# Altium project CU2.PrjPcb
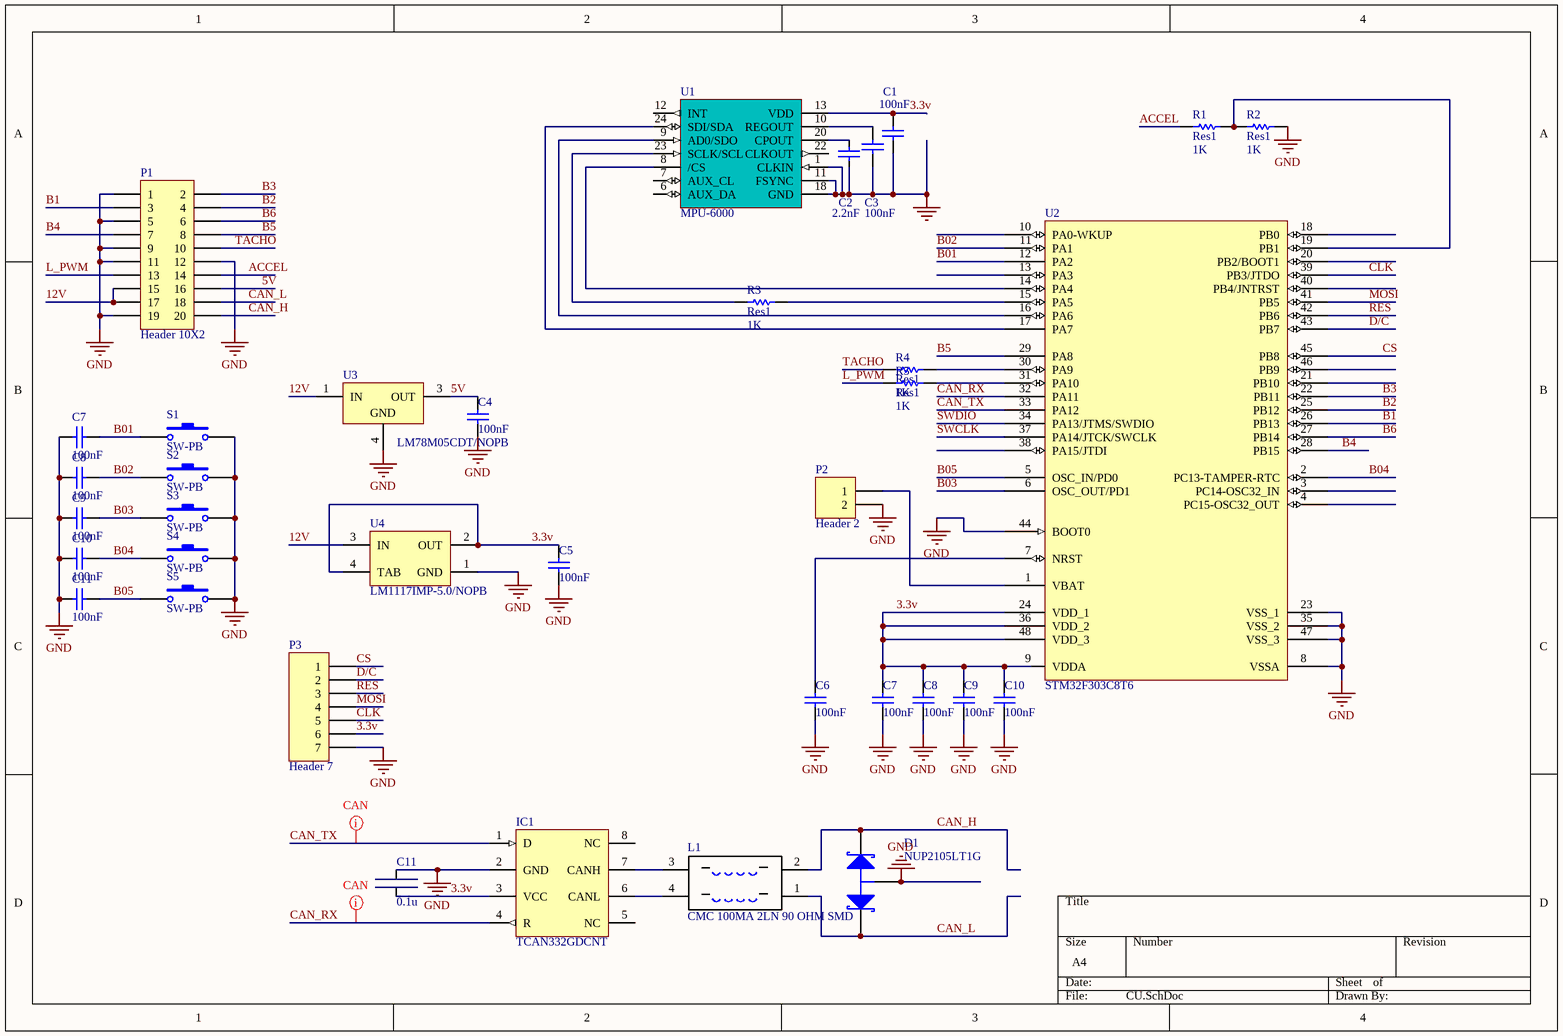
[diagram p0: CU.SchDoc]
1 sheet, 36 parts. Net scope: global (net labels, ports and power ports of the same name join across sheets).
Board file: CU.PcbDoc

## Sheet CU.SchDoc
size A4

### Parts
(Parts that share a designator on the sheet are numbered #1, #2 ... from top to bottom, then left to right.)
C1  value 100nF  [0603x]  (hidden comment: Cap402)
C2  value 2.2nF  [0603x]  (hidden comment: Cap603)
C3  value 100nF  [0402x]  (hidden comment: Cap402)
C4  value 100nF  [RR_B]  (hidden comment: Cap)
C5  value 100nF  [RR_B]  (hidden comment: Cap)
C6  value 100nF  [0603x]  (hidden comment: Cap)
C7#1  value 100nF  [0603x]  (hidden comment: Cap)
C7#2  value 100nF  [0603x]  (hidden comment: Cap)
C8#1  value 100nF  [0603x]  (hidden comment: Cap)
C8#2  value 100nF  [0603x]  (hidden comment: Cap)
C9#1  value 100nF  [0603x]  (hidden comment: Cap)
C9#2  value 100nF  [0603x]  (hidden comment: Cap)
C10#1  value 100nF  [0603x]  (hidden comment: Cap)
C10#2  value 100nF  [0603x]  (hidden comment: Cap)
C11#1  value 100nF  [0603x]  (hidden comment: Cap)
C11#2  0.1u  [CAPC1608X08N(0603)]
D1  NUP2105LT1G  [SOT23_N]
IC1  TCAN332GDCNT  [SOT23-8_L]
L1  CMC 100MA 2LN 90 OHM SMD  [Choke_smd]
P1  Header 10X2  [HDR2X10]
P2  Header 2  [RR_CONN_2032]
P3  Header 7  [HDR1X7]
R1  Res1  value 1K  [0603x]
R2  Res1  value 1K  [0603x]
R3  Res1  value 1K  [0603x]
R4  Res1  value 1K  [0603x]
R5  Res1  value 1K  [0603x]
S1  SW-PB  [BUTTON_SMD]
S2  SW-PB  [BUTTON_SMD]
S3  SW-PB  [BUTTON_SMD]
S4  SW-PB  [BUTTON_SMD]
S5  SW-PB  [BUTTON_SMD]
U1  MPU-6000  [IMU-3000]
U2  STM32F303C8T6  [LQFP48_N]
U3  LM78M05CDT/NOPB  [TD03B_N]
U4  LM1117IMP-5.0/NOPB  [MP04A_N]

### Nets
GND: C1.1 C2.1 C3.2 C4.1 C5.1 C6.1 C7#1.2 C7#2.1 C8#1.2 C8#2.1 C9#1.2 C9#2.1 C10#1.2 C10#2.1 C11#1.2 C11#2.1 D1.3(A) IC1.2(GND) P1.1 P1.5 P1.9 P1.11 P1.12 P1.19 P2.2 P3.7 R2.2 S1.1 S2.1 S3.1 S4.1 S5.1 U1.1(CLKIN) U1.11(FSYNC) U1.18(GND) U2.8(VSSA) U2.23(VSS_1) U2.35(VSS_2) U2.44(BOOT0) U2.47(VSS_3) U3.4(GND) U4.1(GND)
3.3v: C1.2 C5.2 C7#2.2 C8#2.2 C9#2.2 C10#2.2 C11#2.2 IC1.3(VCC) P3.6 U1.13(VDD) U2.9(VDDA) U2.24(VDD_1) U2.36(VDD_2) U2.48(VDD_3) U4.2(OUT) U4.4(TAB)
5V: C4.2 P1.16 U3.3(OUT)
12V: P1.15 P1.17 U3.1(IN) U4.3(IN)
ACCEL: P1.14 R1.1
B01: C7#1.1 S1.2 U2.12(PA2)
B1: P1.3 U2.26(PB13)
B02: C8#1.1 S2.2 U2.11(PA1)
B2: P1.4 U2.25(PB12)
B03: C9#1.1 S3.2 U2.6(OSC_OUT/PD1)
B3: P1.2 U2.22(PB11)
B4: P1.7 U2.28(PB15)
B04: C10#1.1 S4.2 U2.2(PC13-TAMPER-RTC)
B05: C11#1.1 S5.2 U2.5(OSC_IN/PD0)
B5: P1.8 U2.29(PA8)
B6: P1.6 U2.27(PB14)
CAN_H: D1.2(K2) L1.2 P1.20
CAN_L: D1.1(K1) L1.1 P1.18
CAN_RX: IC1.4(R) U2.32(PA11)
CAN_TX: IC1.1(D) U2.33(PA12)
CLK: P3.5 U2.39(PB3/JTDO)
CS: P3.1 U2.45(PB8)
D/C: P3.2 U2.43(PB7)
L_PWM: P1.13 R5.1
MOSI: P3.4 U2.41(PB5)
RES: P3.3 U2.42(PB6)
SWCLK: U2.37(PA14/JTCK/SWCLK)
SWDIO: U2.34(PA13/JTMS/SWDIO)
TACHO: P1.10 R4.1
NetC2_2: C2.2 U1.20(CPOUT)
NetC3_1: C3.1 U1.10(REGOUT)
NetC6_2: C6.2 U2.7(NRST)
NetIC1_6: IC1.6(CANL) L1.4
NetIC1_7: IC1.7(CANH) L1.3
NetP2_1: P2.1 U2.1(VBAT)
NetR1_2: R1.2 R2.1 U2.19(PB1)
NetR3_1: R3.1 U1.23(SCLK/SCL)
NetR3_2: R3.2 U2.15(PA5)
NetR4_2: R4.2 U2.30(PA9)
NetR5_2: R5.2 U2.31(PA10)
NetU1_8: U1.8(/CS) U2.14(PA4)
NetU1_9: U1.9(AD0/SDO) U2.16(PA6)
NetU1_24: U1.24(SDI/SDA) U2.17(PA7)

Not connected (* = marked no-connect by the designer): IC1 5(NC) 8(NC); U1 2(NC) 3(NC) 4(NC) 5(NC) 6(AUX_DA) 7(AUX_CL) 12(INT) 14(NC) 15(NC) 16(NC) 17(NC) 19(RESV) 21(RESV) 22(CLKOUT); U2 3(PC14-OSC32_IN) 4(PC15-OSC32_OUT) 10(PA0-WKUP) 13(PA3) 18(PB0) 20(PB2/BOOT1) 21(PB10) 38(PA15/JTDI) 40(PB4/JNTRST) 46(PB9)

### Layout directives
net class CAN: CAN_RX, CAN_TX

### Library data of the parts
C1 C3 = Cap402: Capacitor SMD; Published: 1-Nov-2010; LatestRevisionDate: 1-Nov-2010; LatestRevisionNote: Released OpenPilot Lib; PackageReference: 0402 (1005 Metric); Publisher: The OpenPilot Project; ComponentLink2Description: Datasheet; Supplier 1: Digi-Key; Supplier Part Number 1: 445-4952-1-ND
C2 = Cap603: Capacitor SMD; Published: 1-Nov-2010; LatestRevisionDate: 1-Nov-2010; LatestRevisionNote: Released OpenPilot Lib; PackageReference: 0603 (1608 Metric); Publisher: The OpenPilot Project; Supplier 1: Digi-Key; Supplier Part Number 1: 445-1309-1-ND
C4-C6 C7#1 C7#2 C8#1 C8#2 C9#1 C9#2 C10#1 C10#2 C11#1 = Cap: Capacitor; Published: 8-Jun-2000; LatestRevisionDate: 17-Jul-2002; LatestRevisionNote: Re-released for DXP Platform.; PackageReference: RAD-0.3; Publisher: Altium Limited; PackageDescription: Radial Cap, Thru-Hole; 2 Leads; 0.3 in Pin Spacing
C11#2 = Ceramic Chip Capacitor: Value: CAP CER 0.1UF 50V X7R 0603; Order Number: 06035C104KAT2A; Distributor: AVX Corporation; Package: 0603
D1 = BAT54A: Schottky Barrier Double Diode; LatestRevisionNote: IPC-7351 Footprint Added.; Package: SOT23; PackageDescription: 3-Pin SOT-23 Package 0.95 mm Pitch, 2.3 mm Lead Span; ComponentLink1Description: Manufacturer Link; ComponentLink1URL: http://www.semiconductors.philips.com/; Value: NUP2105LT1G; Distributor: ON Semiconductor; Order Number: NUP2105LT1G
L1 = Choke: Order Number: EXC-34CG900U; Distributor: Panasonic; Value: CMC 100MA 2LN 90 OHM SMD; Package: 0805 (2012 Metric), 4 PC Pad
P1 = Header 10X2: Header, 10-Pin, Dual row; LatestRevisionDate: 17-Jul-2002; LatestRevisionNote: Re-released for DXP Platform.; Publisher: Altium Limited
P2 = Header 2: Header, 2-Pin; LatestRevisionDate: 17-Jul-2002; LatestRevisionNote: Re-released for DXP Platform.; Publisher: Altium Limited
P3 = Header 7: Header, 7-Pin; LatestRevisionDate: 17-Jul-2002; LatestRevisionNote: Re-released for DXP Platform.; Publisher: Altium Limited
R1-R5 = Res1: Resistor; Published: 8-Jun-2000; LatestRevisionDate: 17-Jul-2002; LatestRevisionNote: Re-released for DXP Platform.; PackageReference: AXIAL-0.3; Publisher: Altium Limited; PackageDescription: Axial Device, Thru-Hole; 2 Leads; 0.3 in Pin Spacing
S1-S5 = SW-PB: Switch; Published: 24-Mar-1999; LatestRevisionDate: 17-Jul-2002; LatestRevisionNote: Re-released for DXP Platform.; PackageReference: SPST-2; Publisher: Altium Limited; PackageDescription: Switch; 2 Leads
U1 = MPU-3/6000: Invensense MPU-3/6000,  3-axis Gyros & Accel on 6000; ComponentLink2Description: Datasheet; LatestRevisionDate: 1-Nov-2010; LatestRevisionNote: Released OpenPilot Lib; Published: 1-Nov-2010; Publisher: The OpenPilot Project; Manufacturer: Invensense; Supplier 1: Invensense; Supplier Part Number 1: MPU-6000
U2 = STM32F103C6T6: STM32 ARM-based 32-bit MCU with 32 Kbytes Flash, 48-pin LQFP, Industrial Temperature; Published: 30-May-2008; DatasheetVersion: rev6, Mar-2008; PackageVersion: Mar-2008; PackageReference: LQFP48; Publisher: Altium Limited; PackageDescription: 48-Pin Low-Profile Quad Flat Pack, 7 x 7 mm Body, 0.5 mm Pitch (LQFP48); ComponentLink1Description: Manufacturer Link; ComponentLink1URL: www.st.com/stm32; ComponentLink2Description: Datasheet; ComponentLink2URL: http://www.st.com/stonline/products/literature/ds/13587.pdf
U3 = LM78M05CDT/NOPB: 3-Terminal Positive Voltage Regulators, 3-pin TO-252, Pb-Free; Manufacturer: National Semiconductor; PackageTopMarking: NSUZXYTT*LM78M05*CDT; PowerWise: N; CompType: LDO IC; Published: 1-Mar-2010; DatasheetVersion: Aug-2005; PackageVersion: revD, Feb-2009; PackageReference: TD03B; Publisher: Altium Limited; PackageDescription: TO252, Molded, Jedec, 6.8 x 6.10 x 2.30mm Body, 3 Lead, 2.28mm Pitch, Surface Mount; Supplier 1: Digi-Key; Supplier Part Number 1: LM78M05CDT-ND; Supplier 2: Farnell; Supplier Part Number 2: 1469112; PartNumber: LM78M05CDT/NOPB; RoHS: Y; PinCount: 3; Code_JEDEC: TO-252-AA; ComponentLink1Description: LM78M05 Datasheet; ComponentLink1URL: http://www.national.com/ds/LM/LM78M05.pdf; ComponentLink2Description: LM78M05 Web Page; ComponentLink2URL: http://www.national.com/pf/LM/LM78M05.html; ComponentLink3Description: TD03B Package Page; ComponentLink3URL: http://www.national.com/packaging/folders/td03b.html
U4 = LM1117IMP-5.0/NOPB: 800mA Low-Dropout Linear Regulator, 4-pin SOT-223, Pb-Free; Manufacturer: National Semiconductor; PackageTopMarking: XYTT*N06B; PowerWise: N; CompType: LDO IC; Published: 1-Mar-2010; DatasheetVersion: Apr-2006; PackageVersion: revB, Apr-2003; PackageReference: MP04A; Publisher: Altium Limited; PackageDescription: Molded SOT-223, 6.50 x 3.56 x 1.6mm Body, 4 Lead, 2.3mm Pitch; Supplier 1: Digi-Key; Supplier Part Number 1: LM1117IMP-5.0TR-ND; Supplier 2: Digi-Key; Supplier Part Number 2: LM1117IMP-5.0CT-ND; Supplier 3: Digi-Key; Supplier Part Number 3: LM1117IMP-5.0DKR-ND; Supplier 4: Farnell; Supplier Part Number 4: 1469052; PartNumber: LM1117IMP-5.0/NOPB; RoHS: Y; PinCount: 4; Code_JEDEC: TO-261-AA; Code_IPC: SOT223-4; ComponentLink1Description: LM1117 Datasheet; ComponentLink1URL: http://www.national.com/ds/LM/LM1117.pdf; ComponentLink2Description: LM1117 Web Page; ComponentLink2URL: http://www.national.com/pf/LM/LM1117.html; ComponentLink3Description: MP04A Package Page; ComponentLink3URL: http://www.national.com/packaging/folders/mp04a.html
IC1 = TCAN332GDCNT: Order Number: TCAN332GDCNT; Package: SOT23-8; Value: TCAN332GDCNT; Distributor: Texas Instruments